# Altium schematic sheet FPC-v4.0.SchDoc
size A4; SheetNumber: 3; SheetTotal: 3
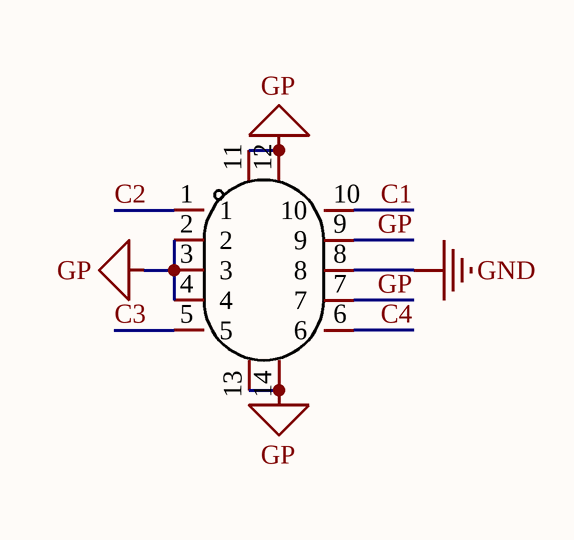
[diagram p0: FPC-v4.0.SchDoc]

## Parts
J?  BM24-10DP/2-0.35V(51)  [CONN-SMD_BM24-10DP-2-0.35V-51]  (value not drawn)

## Nets
GND: J?.8
GP: J?.2 J?.3 J?.4 J?.7 J?.9 J?.11 J?.12 J?.13 J?.14
C1: J?.10
C2: J?.1
C3: J?.5
C4: J?.6

## Library data of the parts
J? = BM24-10DP/2-0.35V(51): 板对板连接器; Manufacturer: HRS(广濑); Add into BOM: yes; Pitch: 0.35mm; Gender: 公; Current Rating (Max): 5A; Name: BM24-10DP/2-0.35V(51); Symbol: BM24-10DP/2-0.35V(51); Device: BM24-10DP/2-0.35V(51); LCSC Part Name: BTB板对板,BM24系列,0.35间距,10PIN公座; Supplier Part: C424554; Manufacturer Part: BM24-10DP/2-0.35V(51); Supplier Footprint: SMD,P=0.35mm; JLCPCB Part Class: Extended Part; Supplier: LCSC; Convert to PCB: yes; Number of Pins: 10; Number of Rows: 2; Mounting Style: 立贴; Operating Temperature Range: -40℃~+85℃